# EAGLE design Butterfly_One (EAGLE 5.06)
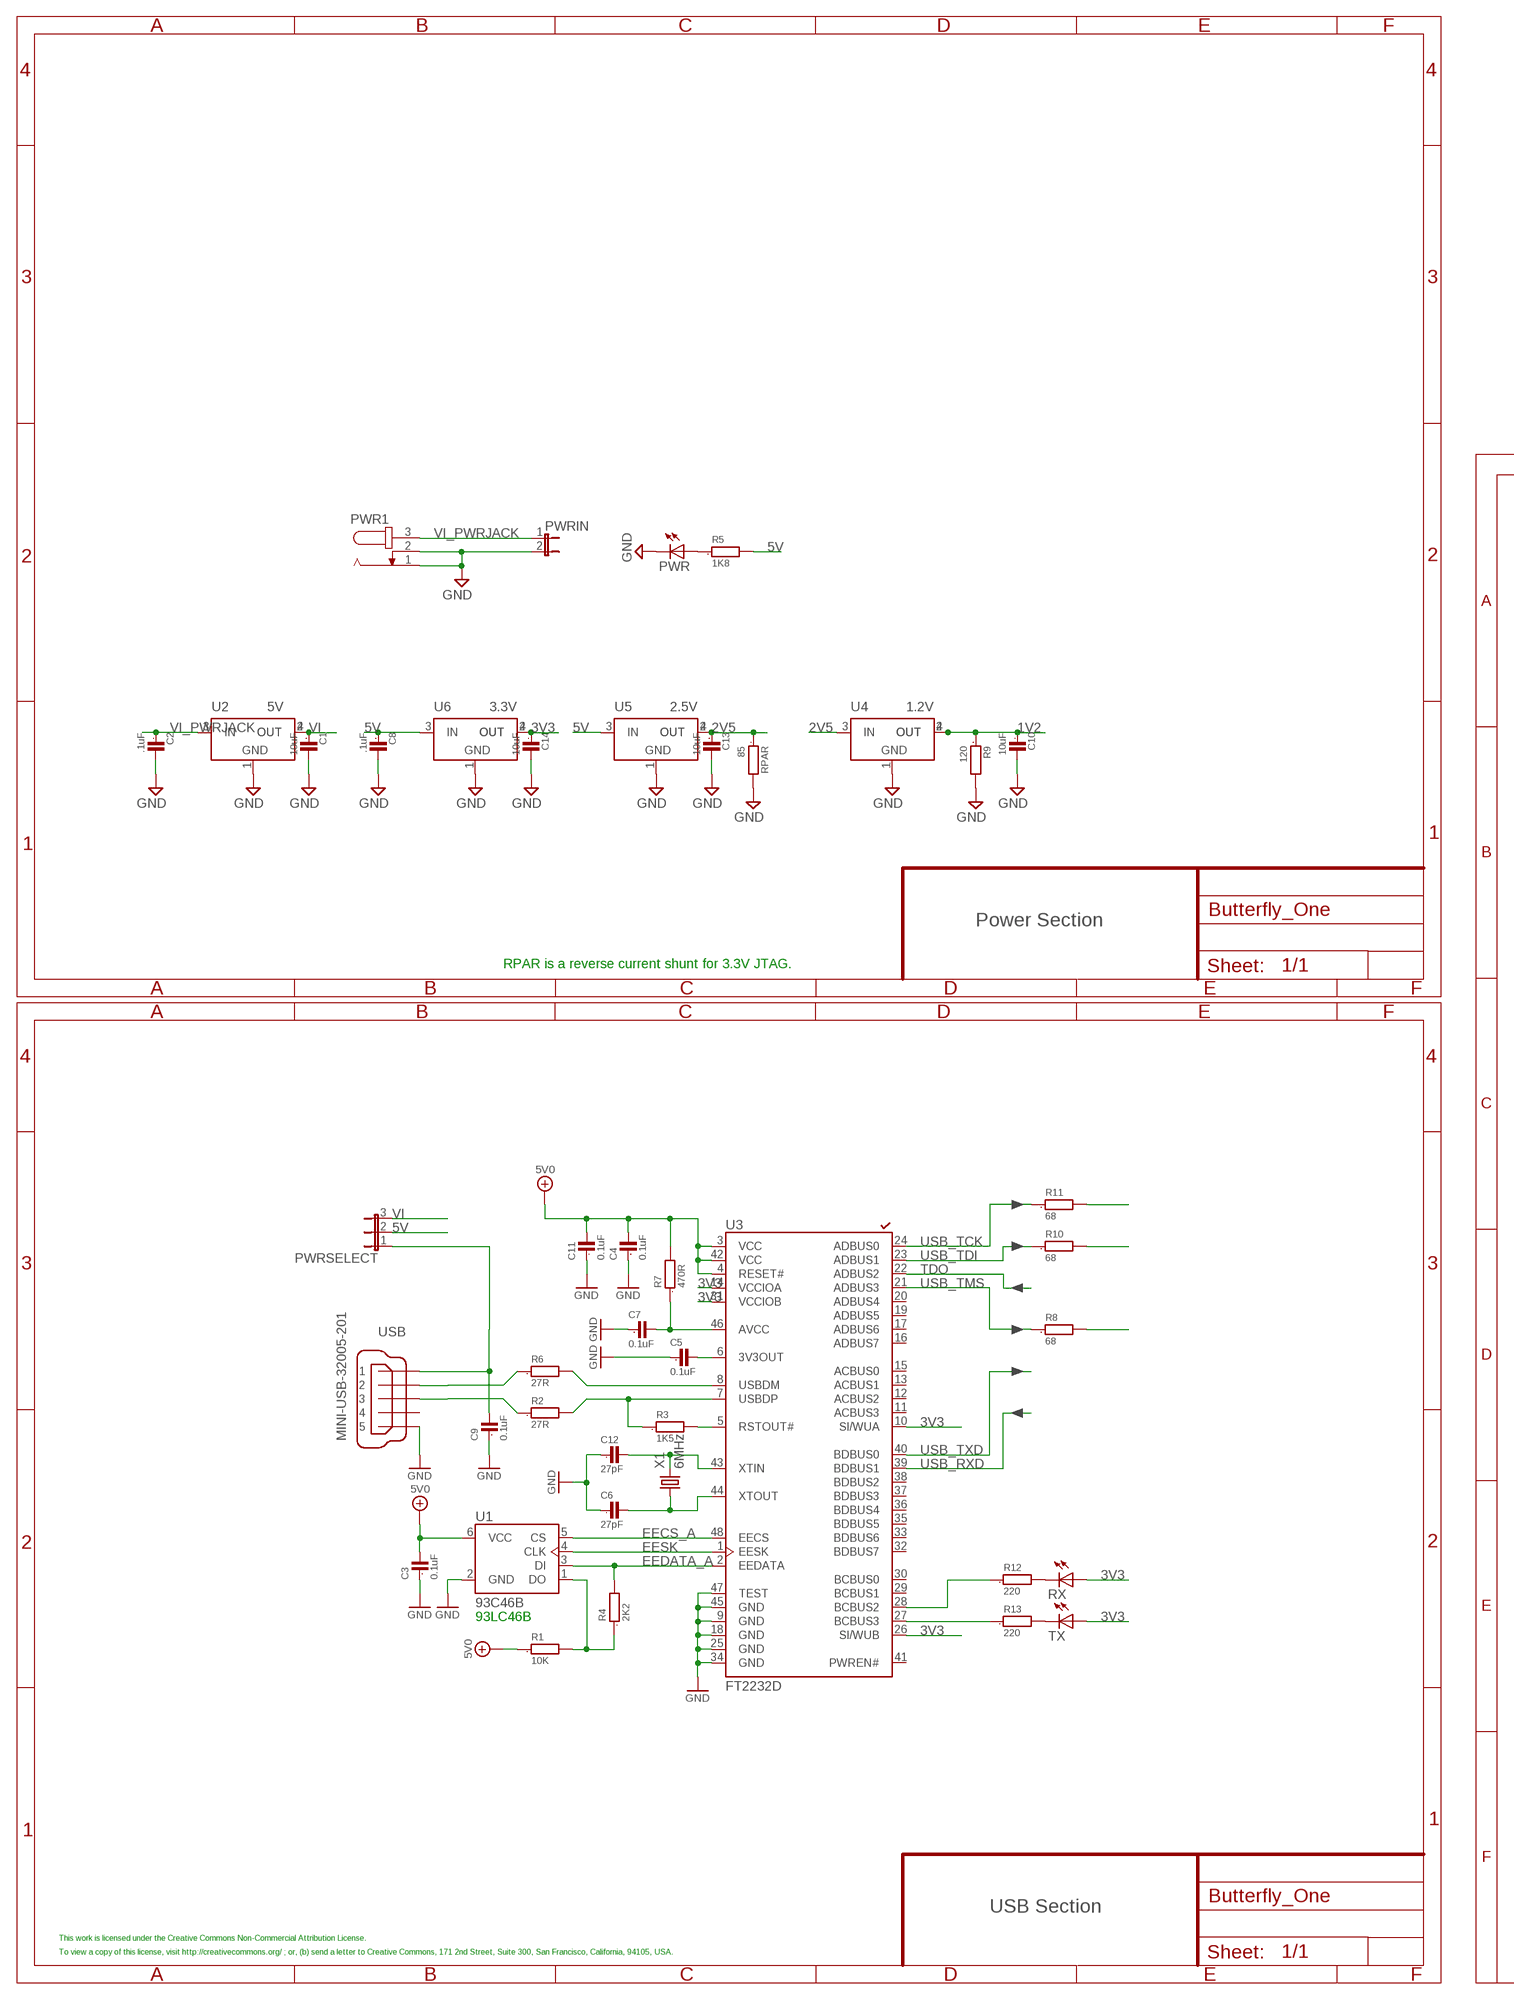
[diagram p0: schematic, sheet 1, part 1 of 2]
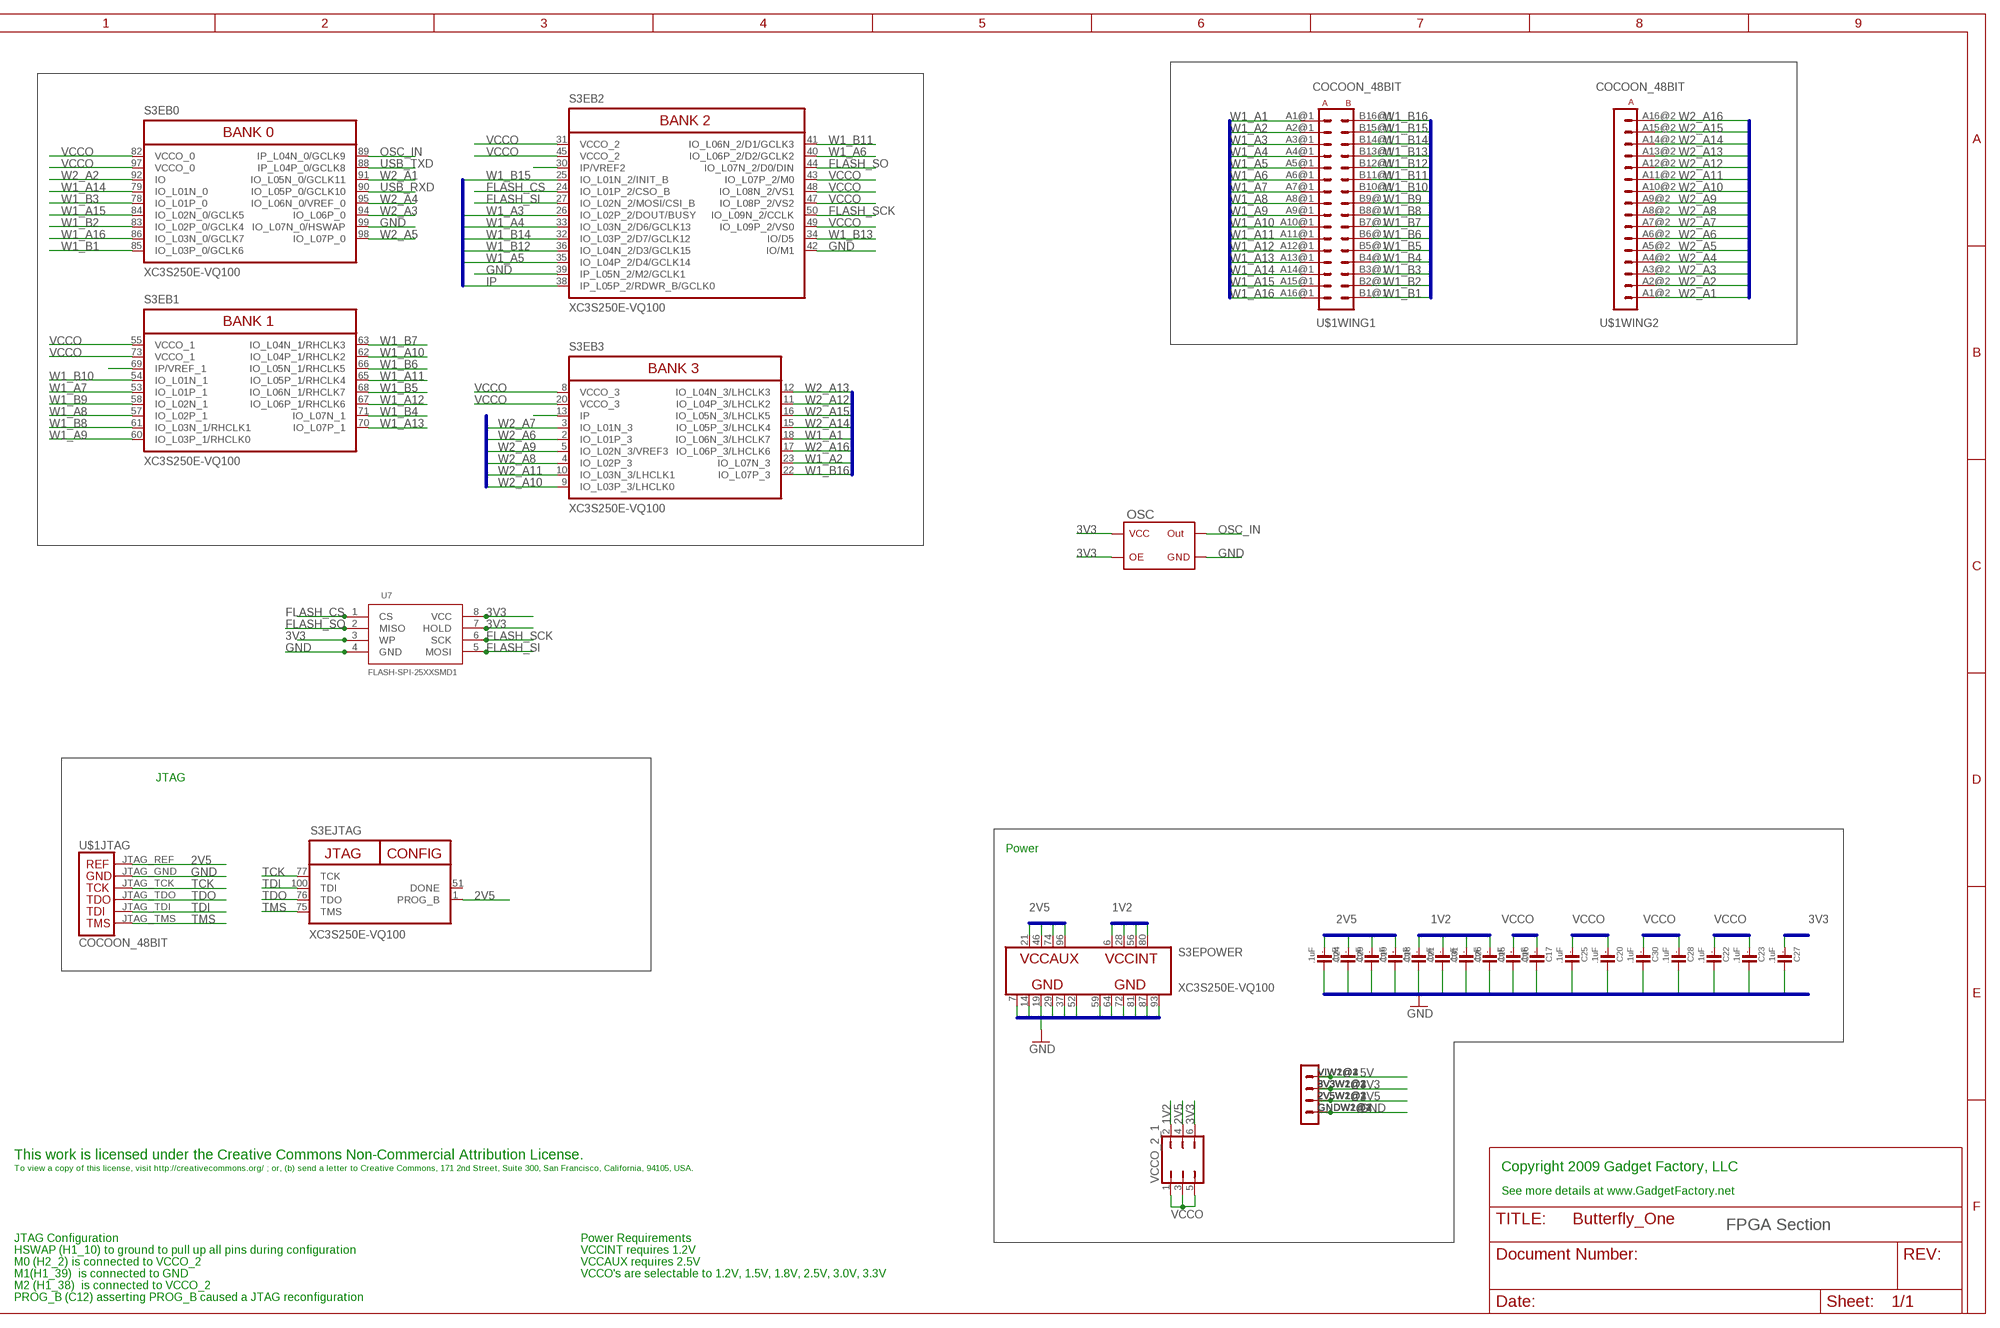
[diagram p1: schematic, sheet 1, part 2 of 2]

## Parts
C1  10uF  C0805  [0805]
C2  .1uF  C0805  [0805]
C3  0.1uF  C0805  [0805]
C4  0.1uF  C0805  [0805]
C5  0.1uF  C0805  [0805]
C6  27pF  C0805  [0805]
C7  0.1uF  C0805  [0805]
C8  .1uF  C0805  [0805]
C9  0.1uF  C0805  [0805]
C10  10uF  C0805  [0805]
C11  0.1uF  C0805  [0805]
C12  27pF  C0805  [0805]
C13  10uF  C0805  [0805]
C14  10uF  C0805  [0805]
C15  .1uF  C0603  [0603]
C16  .1uF  C0603  [0603]
C17  .1uF  C0603  [0603]
C18  .1uF  C0603  [0603]
C19  .1uF  C0603  [0603]
C20  .1uF  C0603  [0603]
C21  .1uF  C0603  [0603]
C22  .1uF  C0603  [0603]
C23  .1uF  C0603  [0603]
C24  .1uF  C0603  [0603]
C25  .1uF  C0603  [0603]
C26  .1uF  C0603  [0603]
C27  .1uF  C0603  [0603]
C28  .1uF  C0603  [0603]
C29  .1uF  C0603  [0603]
C30  .1uF  C0603  [0603]
C31  .1uF  C0603  [0603]
OSC  OSC1  [OSC1]
PWR  LEDCHIP-LED0805  [CHIP-LED0805]
PWR1  JACK-PLUG  [SPC4078-NOSLOT]
PWRIN  JP1E  [JP1]
PWRSELECT  JP2E  [JP2]
R1  10K  R0805  [0805@1]
R2  27R  R0805  [0805@1]
R3  1K5  R0805  [0805@1]
R4  2K2  R0805  [0805@1]
R5  1K8  R0805  [0805]
R6  27R  R0805  [0805@1]
R7  470R  R0805  [0805@1]
R8  68  R0805  [0805]
R9  120  R0805  [0805@1]
R10  68  R0805  [0805]
R11  68  R0805  [0805]
R12  220  R0805  [0805]
R13  220  R0805  [0805]
RPAR  85  R0805  [0805@1]
RX  LEDCHIP-LED0805  [CHIP-LED0805]
S3E  XC3S250E-VQ100  [VQ100]
TX  LEDCHIP-LED0805  [CHIP-LED0805]
U1  93C46B  DIGITAL-EEPROM-MICROWIRE-6P_SOT23  [SOT23-6]
U2  5V  LD1117  [SOT223]
U3  FT2232D  [LQFP48]
U4  1.2V  LD1117  [SOT223]
U5  2.5V  LD1117  [SOT223]
U6  3.3V  LD1117  [SOT223]
U7  FLASH-SPI-25XXSMD1  [SO08-EIAJ]
U$1  COCOON_48BIT  [COCOON_48BIT]
USB  MINI-USB-32005-201  [32005-201]
VCCO_2_1  JP3Q  [JP3Q]
X1  6MHz  CRYSTALHC49S  [HC49/S]

## Nets
1V2: C10.1 C15.1 C21.1 C26.1 C31.1 R9.1 S3E.6(POWER:VCCINT) S3E.28(POWER:VCCINT) S3E.56(POWER:VCCINT) S3E.80(POWER:VCCINT) U4.2(OUT) U4.4(OUT) VCCO_2_1.2
2V5: C13.1 C18.1 C19.1 C24.1 C29.1 RPAR.1 S3E.1(JTAG:PROG_B) S3E.21(POWER:VCCAUX) S3E.46(POWER:VCCAUX) S3E.74(POWER:VCCAUX) S3E.96(POWER:VCCAUX) U4.3(IN) U5.2(OUT) U5.4(OUT) U$1.2V5W1@1(2V5) U$1.2V5W1@2(2V5) U$1.2V5W1@3(2V5) U$1.2V5W1@4(2V5) U$1.2V5W2@1(2V5) U$1.2V5W2@2(2V5) U$1.JTAG_REF(JTAG:JTAG_REF) VCCO_2_1.4
3V3: C14.1 C27.1 OSC.1@1(OE) OSC.4@4(VCC) RX.A TX.A U3.10(SI/WUA) U3.14(VCCIOA) U3.26(SI/WUB) U3.31(VCCIOB) U6.2(OUT) U6.4(OUT) U7.3(WP) U7.7(HOLD) U7.8(VCC) U$1.3V3W1@1(3V3) U$1.3V3W1@2(3V3) U$1.3V3W1@3(3V3) U$1.3V3W1@4(3V3) U$1.3V3W2@1(3V3) U$1.3V3W2@2(3V3) VCCO_2_1.6
3V3OUT_A: C5.2 U3.6(3V3OUT)
5V: C3.2 C4.2 C8.1 C11.2 PWRSELECT.2 R1.1 R5.2 R7.2 U1.6(VCC) U3.3(VCC) U3.4(RESET#) U3.42(VCC) U5.3(IN) U6.3(IN) U$1.VIW1@1(5V) U$1.VIW1@2(5V) U$1.VIW1@3(5V) U$1.VIW1@4(5V) U$1.VIW2@1(5V) U$1.VIW2@2(5V) ; supply symbol labelled 5V0
D+: R2.1 USB.3
D-: R6.1 USB.2
DO_A: R1.2 R4.1 U1.1(DO)
EECS_A: U1.5(CS) U3.48(EECS)
EEDATA_A: R4.2 U1.3(DI) U3.2(EEDATA)
EESK: U1.4(CLK) U3.1(EESK)
FILTERED_VCC_A: C7.2 R7.1 U3.46(AVCC)
FLASH_CS: S3E.24(B2:IO_L01P_2/CSO_B) U7.1(CS)
FLASH_SCK: S3E.50(B2:IO_L09N_2/CCLK) U7.6(SCK)
FLASH_SI: S3E.27(B2:IO_L02N_2/MOSI/CSI_B) U7.5(MOSI)
FLASH_SO: S3E.44(B2:IO_L07N_2/D0/DIN) U7.2(MISO)
GND: C1.2 C2.2 C3.1 C4.1 C5.1 C6.1 C7.1 C8.2 C9.1 C10.2 C11.1 C12.1 C13.2 C14.2 C15.2 C16.2 C17.2 C18.2 C19.2 C20.2 C21.2 C22.2 C23.2 C24.2 C25.2 C26.2 C27.2 C28.2 C29.2 C30.2 C31.2 OSC.2@2(GND) PWR1.1 PWR1.2 PWR.C PWRIN.2 R9.2 RPAR.2 S3E.7(POWER:GND) S3E.14(POWER:GND) S3E.19(POWER:GND) S3E.29(POWER:GND) S3E.37(POWER:GND) S3E.39(B2:IP_L05N_2/M2/GCLK1) S3E.42(B2:IO/M1) S3E.52(POWER:GND) S3E.59(POWER:GND) S3E.64(POWER:GND) S3E.72(POWER:GND) S3E.81(POWER:GND) S3E.87(POWER:GND) S3E.93(POWER:GND) S3E.99(B0:IO_L07N_0/HSWAP) U1.2(GND) U2.1(GND) U3.9(GND) U3.18(GND) U3.25(GND) U3.34(GND) U3.45(GND) U3.47(TEST) U4.1(GND) U5.1(GND) U6.1(GND) U7.4(GND) U$1.GNDW1@1(GND) U$1.GNDW1@2(GND) U$1.GNDW1@3(GND) U$1.GNDW1@4(GND) U$1.GNDW2@1(GND) U$1.GNDW2@2(GND) U$1.JTAG_GND(JTAG:JTAG_GND) USB.5
H1_20: S3E.13(B3:IP)
H1_29: S3E.30(B2:IP/VREF2)
H2_20: S3E.69(B1:IP/VREF_1)
IP: S3E.38(B2:IP_L05P_2/RDWR_B/GCLK0)
N$1: PWR.A R5.1
N$2: R12.2 RX.C
N$3: R13.2 TX.C
N$4: R13.1 U3.27(BCBUS3)
N$5: R12.1 U3.28(BCBUS2)
N$15_A: R3.2 U3.5(RSTOUT#)
OSC_IN: OSC.3@3(OUT) S3E.89(B0:IP_L04N_0/GCLK9)
TCK: R11.2 S3E.77(JTAG:TCK) U$1.JTAG_TCK(JTAG:JTAG_TCK)
TDI: R10.2 S3E.100(JTAG:TDI) U$1.JTAG_TDI(JTAG:JTAG_TDI)
TDO: S3E.76(JTAG:TDO) U3.22(ADBUS2) U$1.JTAG_TDO(JTAG:JTAG_TDO)
TMS: R8.2 S3E.75(JTAG:TMS) U$1.JTAG_TMS(JTAG:JTAG_TMS)
USB_RXD: S3E.90(B0:IO_L05P_0/GCLK10) U3.39(BDBUS1)
USB_TCK: R11.1 U3.24(ADBUS0)
USB_TDI: R10.1 U3.23(ADBUS1)
USB_TMS: R8.1 U3.21(ADBUS3)
USB_TXD: S3E.88(B0:IP_L04P_0/GCLK8) U3.40(BDBUS0)
USBDM_A: R6.2 U3.8(USBDM)
USBDP_A: R2.2 R3.1 U3.7(USBDP)
VBUS_A: C9.2 PWRSELECT.1 USB.1
VCCO: C16.1 C17.1 C20.1 C22.1 C23.1 C25.1 C28.1 C30.1 S3E.8(B3:VCCO_3) S3E.20(B3:VCCO_3) S3E.31(B2:VCCO_2) S3E.43(B2:IO_L07P_2/M0) S3E.45(B2:VCCO_2) S3E.47(B2:IO_L08P_2/VS2) S3E.48(B2:IO_L08N_2/VS1) S3E.49(B2:IO_L09P_2/VS0) S3E.55(B1:VCCO_1) S3E.73(B1:VCCO_1) S3E.82(B0:VCCO_0) S3E.97(B0:VCCO_0) VCCO_2_1.1 VCCO_2_1.3 VCCO_2_1.5
VI: C1.1 PWRSELECT.3 U2.2(OUT) U2.4(OUT)
VI_PWRJACK: C2.1 PWR1.3 PWRIN.1 U2.3(IN)
W1_A1: S3E.18(B3:IO_L06N_3/LHCLK7) U$1.A1@1(WING1:A1)
W1_A2: S3E.23(B3:IO_L07N_3) U$1.A2@1(WING1:A2)
W1_A3: S3E.26(B2:IO_L02P_2/DOUT/BUSY) U$1.A3@1(WING1:A3)
W1_A4: S3E.33(B2:IO_L03N_2/D6/GCLK13) U$1.A4@1(WING1:A4)
W1_A5: S3E.35(B2:IO_L04P_2/D4/GCLK14) U$1.A5@1(WING1:A5)
W1_A6: S3E.40(B2:IO_L06P_2/D2/GCLK2) U$1.A6@1(WING1:A6)
W1_A7: S3E.53(B1:IO_L01P_1) U$1.A7@1(WING1:A7)
W1_A8: S3E.57(B1:IO_L02P_1) U$1.A8@1(WING1:A8)
W1_A9: S3E.60(B1:IO_L03P_1/RHCLK0) U$1.A9@1(WING1:A9)
W1_A10: S3E.62(B1:IO_L04P_1/RHCLK2) U$1.A10@1(WING1:A10)
W1_A11: S3E.65(B1:IO_L05P_1/RHCLK4) U$1.A11@1(WING1:A11)
W1_A12: S3E.67(B1:IO_L06P_1/RHCLK6) U$1.A12@1(WING1:A12)
W1_A13: S3E.70(B1:IO_L07P_1) U$1.A13@1(WING1:A13)
W1_A14: S3E.79(B0:IO_L01N_0) U$1.A14@1(WING1:A14)
W1_A15: S3E.84(B0:IO_L02N_0/GCLK5) U$1.A15@1(WING1:A15)
W1_A16: S3E.86(B0:IO_L03N_0/GCLK7) U$1.A16@1(WING1:A16)
W1_B1: S3E.85(B0:IO_L03P_0/GCLK6) U$1.B1@1(WING1:B1)
W1_B2: S3E.83(B0:IO_L02P_0/GCLK4) U$1.B2@1(WING1:B2)
W1_B3: S3E.78(B0:IO_L01P_0) U$1.B3@1(WING1:B3)
W1_B4: S3E.71(B1:IO_L07N_1) U$1.B4@1(WING1:B4)
W1_B5: S3E.68(B1:IO_L06N_1/RHCLK7) U$1.B5@1(WING1:B5)
W1_B6: S3E.66(B1:IO_L05N_1/RHCLK5) U$1.B6@1(WING1:B6)
W1_B7: S3E.63(B1:IO_L04N_1/RHCLK3) U$1.B7@1(WING1:B7)
W1_B8: S3E.61(B1:IO_L03N_1/RHCLK1) U$1.B8@1(WING1:B8)
W1_B9: S3E.58(B1:IO_L02N_1) U$1.B9@1(WING1:B9)
W1_B10: S3E.54(B1:IO_L01N_1) U$1.B10@1(WING1:B10)
W1_B11: S3E.41(B2:IO_L06N_2/D1/GCLK3) U$1.B11@1(WING1:B11)
W1_B12: S3E.36(B2:IO_L04N_2/D3/GCLK15) U$1.B12@1(WING1:B12)
W1_B13: S3E.34(B2:IO/D5) U$1.B13@1(WING1:B13)
W1_B14: S3E.32(B2:IO_L03P_2/D7/GCLK12) U$1.B14@1(WING1:B14)
W1_B15: S3E.25(B2:IO_L01N_2/INIT_B) U$1.B15@1(WING1:B15)
W1_B16: S3E.22(B3:IO_L07P_3) U$1.B16@1(WING1:B16)
W2_A1: S3E.91(B0:IO_L05N_0/GCLK11) U$1.A1@2(WING2:A1)
W2_A2: S3E.92(B0:IO) U$1.A2@2(WING2:A2)
W2_A3: S3E.94(B0:IO_L06P_0) U$1.A3@2(WING2:A3)
W2_A4: S3E.95(B0:IO_L06N_0/VREF_0) U$1.A4@2(WING2:A4)
W2_A5: S3E.98(B0:IO_L07P_0) U$1.A5@2(WING2:A5)
W2_A6: S3E.2(B3:IO_L01P_3) U$1.A6@2(WING2:A6)
W2_A7: S3E.3(B3:IO_L01N_3) U$1.A7@2(WING2:A7)
W2_A8: S3E.4(B3:IO_L02P_3) U$1.A8@2(WING2:A8)
W2_A9: S3E.5(B3:IO_L02N_3/VREF3) U$1.A9@2(WING2:A9)
W2_A10: S3E.9(B3:IO_L03P_3/LHCLK0) U$1.A10@2(WING2:A10)
W2_A11: S3E.10(B3:IO_L03N_3/LHCLK1) U$1.A11@2(WING2:A11)
W2_A12: S3E.11(B3:IO_L04P_3/LHCLK2) U$1.A12@2(WING2:A12)
W2_A13: S3E.12(B3:IO_L04N_3/LHCLK3) U$1.A13@2(WING2:A13)
W2_A14: S3E.15(B3:IO_L05P_3/LHCLK4) U$1.A14@2(WING2:A14)
W2_A15: S3E.16(B3:IO_L05N_3/LHCLK5) U$1.A15@2(WING2:A15)
W2_A16: S3E.17(B3:IO_L06P_3/LHCLK6) U$1.A16@2(WING2:A16)
XTIN_A: C12.2 U3.43(XTIN) X1.2
XTOUT_A: C6.2 U3.44(XTOUT) X1.1
Unconnected: S3E.51(JTAG:DONE) U3.11(ACBUS3) U3.12(ACBUS2) U3.13(ACBUS1) U3.15(ACBUS0) U3.16(ADBUS7) U3.17(ADBUS6) U3.19(ADBUS5) U3.20(ADBUS4) U3.29(BCBUS1) U3.30(BCBUS0) U3.32(BDBUS7) U3.33(BDBUS6) U3.35(BDBUS5) U3.36(BDBUS4) U3.37(BDBUS3) U3.38(BDBUS2) U3.41(PWREN#) USB.4

## Buses
H1_[1..40]
GND
2V5
1V2
H2_[1..40]
VCCO
3V3
W1_A[1..16],W1_B[1..16]

## Notes on the sheet
- Power Section
- RPAR is a reverse current shunt for 3.3V JTAG.
- JTAG
- Power
- 93LC46B
- This work is licensed under the Creative Commons Non-Commercial Attribution License.
- To view a copy of this license, visit http://creativecommons.org/ ; or, (b) send a letter to Creative Commons, 171 2nd Street, Suite 300, San Francisco, California, 94105, USA. | Copyright 2009 Gadget Factory, LLC
- See more details at www.GadgetFactory.net
- FPGA Section
- JTAG Configuration | Power Requirements
- USB Section | HSWAP (H1_10) to ground to pull up all pins during configuration | VCCINT requires 1.2V
- M0 (H2_2) is connected to VCCO_2 | VCCAUX requires 2.5V
- This work is licensed under the Creative Commons Non-Commercial Attribution License. | M1(H1_39)  is connected to GND | VCCO's are selectable to 1.2V, 1.5V, 1.8V, 2.5V, 3.0V, 3.3V
- To view a copy of this license, visit http://creativecommons.org/ ; or, (b) send a letter to Creative Commons, 171 2nd Street, Suite 300, San Francisco, California, 94105, USA. | M2 (H1_38)  is connected to VCCO_2
- PROG_B (C12) asserting PROG_B caused a JTAG reconfiguration

## Library data of the parts
C1 C2 C8 C10 C13-C31 = GadgetFactory:C: CAPACITOR, European symbol
C3-C7 C9 C11 C12 = Bogdan_Commons:C: CAPACITOR, European symbol
OSC = MondoCPLDCore-XC95_Rev1.5:OSC1
PWR RX TX = led:LED: LED OSRAM: - CHIPLED LG R971, LG N971, LY N971, LG Q971, LY Q971, LO R971, LY R971 LH N974, LH R974 LS Q976, LO Q976, LY Q976 LO Q996 - Hyper CHIPLED LW Q18S LB Q993, LB Q99A, LB R99A - SideLED LS A670, LO A670, LY A670, LG A670, LP A670 LB A673, LV A673, LT A673, LW A673 LH A674 LY A675 LS A676, LA A676, LO A676, LY A676, LW A676 LS A679, LY A679, LG A679 - Hyper Micro SIDELED® LS Y876, LA Y876, LO Y876, LY Y876 LT Y87S - SmartLED LW L88C, LW L88S LB L89C, LB L89S, LG L890 LS L89K, LO L89K, LY L89K LS L896, LA L896, LO L896, LY L896 - TOPLED LS T670, LO T670, LY T670, LG T670, LP T670 LSG T670, LSP T670, LSY T670, LOP T670, LYG T670 LG T671, LOG T671, LSG T671 LB T673, LV T673, LT T673, LW T673 LH T674 LS T676, LA T676, LO T676, LY T676, LB T676, LH T676, LSB T676, LW T676 LB T67C, LV T67C, LT T67C, LS T67K, LO T67K, LY T67K, LW E67C LS E67B, LA E67B, LO E67B, LY E67B, LB E67C, LV E67C, LT E67C LW T67C LS T679, LY T679, LG T679 LS T770, LO T770, LY T770, LG T770, LP T770 LB T773, LV T773, LT T773, LW T773 LH T774 LS E675, LA E675, LY E675, LS T675 LS T776, LA T776, LO T776, LY T776, LB T776 LHGB T686 LT T68C, LB T68C - Hyper Mini TOPLED® LB M676 - Mini TOPLED Santana® LG M470 LS M47K, LO M47K, LY M47K Source: http://www.osram.convergy.de LUXEON: - LUMILED® LXK2-PW12-R00, LXK2-PW12-S00, LXK2-PW14-U00, LXK2-PW14-V00 LXK2-PM12-R00, LXK2-PM12-S00, LXK2-PM14-U00 LXK2-PE12-Q00, LXK2-PE12-R00, LXK2-PE12-S00, LXK2-PE14-T00, LXK2-PE14-U00 LXK2-PB12-K00, LXK2-PB12-L00, LXK2-PB12-M00, LXK2-PB14-N00, LXK2-PB14-P00, LXK2-PB14-Q00 LXK2-PR12-L00, LXK2-PR12-M00, LXK2-PR14-Q00, LXK2-PR14-R00 LXK2-PD12-Q00, LXK2-PD12-R00, LXK2-PD12-S00 LXK2-PH12-R00, LXK2-PH12-S00 LXK2-PL12-P00, LXK2-PL12-Q00, LXK2-PL12-R00 Source: www.luxeon.com KINGBRIGHT: KA-3528ASYC Source: www.kingbright.com
PWR1 = GadgetFactory:JACK-PLUG: DC POWER JACK Power Jack, DC, Right Angle, Through Hole, Rated 5A at 16VDC, PC Terminals Distributor: Farnell (www.Farnell.de) Drawing: 84N1161.pdf / 84N1162.pdf Manufacturer: SPC Technology (www.spctechnology.com) Type: SPC4077 / SPC 4078
PWRIN = jumper:JP1E: JUMPER
PWRSELECT = jumper:JP2E: JUMPER
R1-R4 R6 R7 R9 RPAR = Bogdan_Commons:R: RESISTOR, European symbol
R5 R8 R10-R13 = GadgetFactory:R: RESISTOR, European symbol
S3E = xilinx-xc3sxxxe_vq100:XC3S250E: Xilinx Spartan 3E FPGA
U1 = Bogdan_Commons:DIGITAL-EEPROM-MICROWIRE-6P
U2 U4-U6 = GadgetFactory:LD1117
U3 = Bogdan_Commons:FT2232D
U7 = GadgetFactory:FLASH-SPI-25XX: SPI Flash
U$1 = GadgetFactory_Pub:COCOON_48BIT
USB = con-cypressindustries:MINI-USB-: MINI USB-B Conector Source: www.cypressindustries.com
VCCO_2_1 = GadgetFactory:JP3Q: JUMPER
X1 = crystal:CRYSTAL: CRYSTAL

## Net classes
0 default: width 0.178 mm, drill 0.381 mm, clearance 0.178 mm
1 Power: width 0.813 mm, drill 0.381 mm, clearance 0.178 mm

## Board
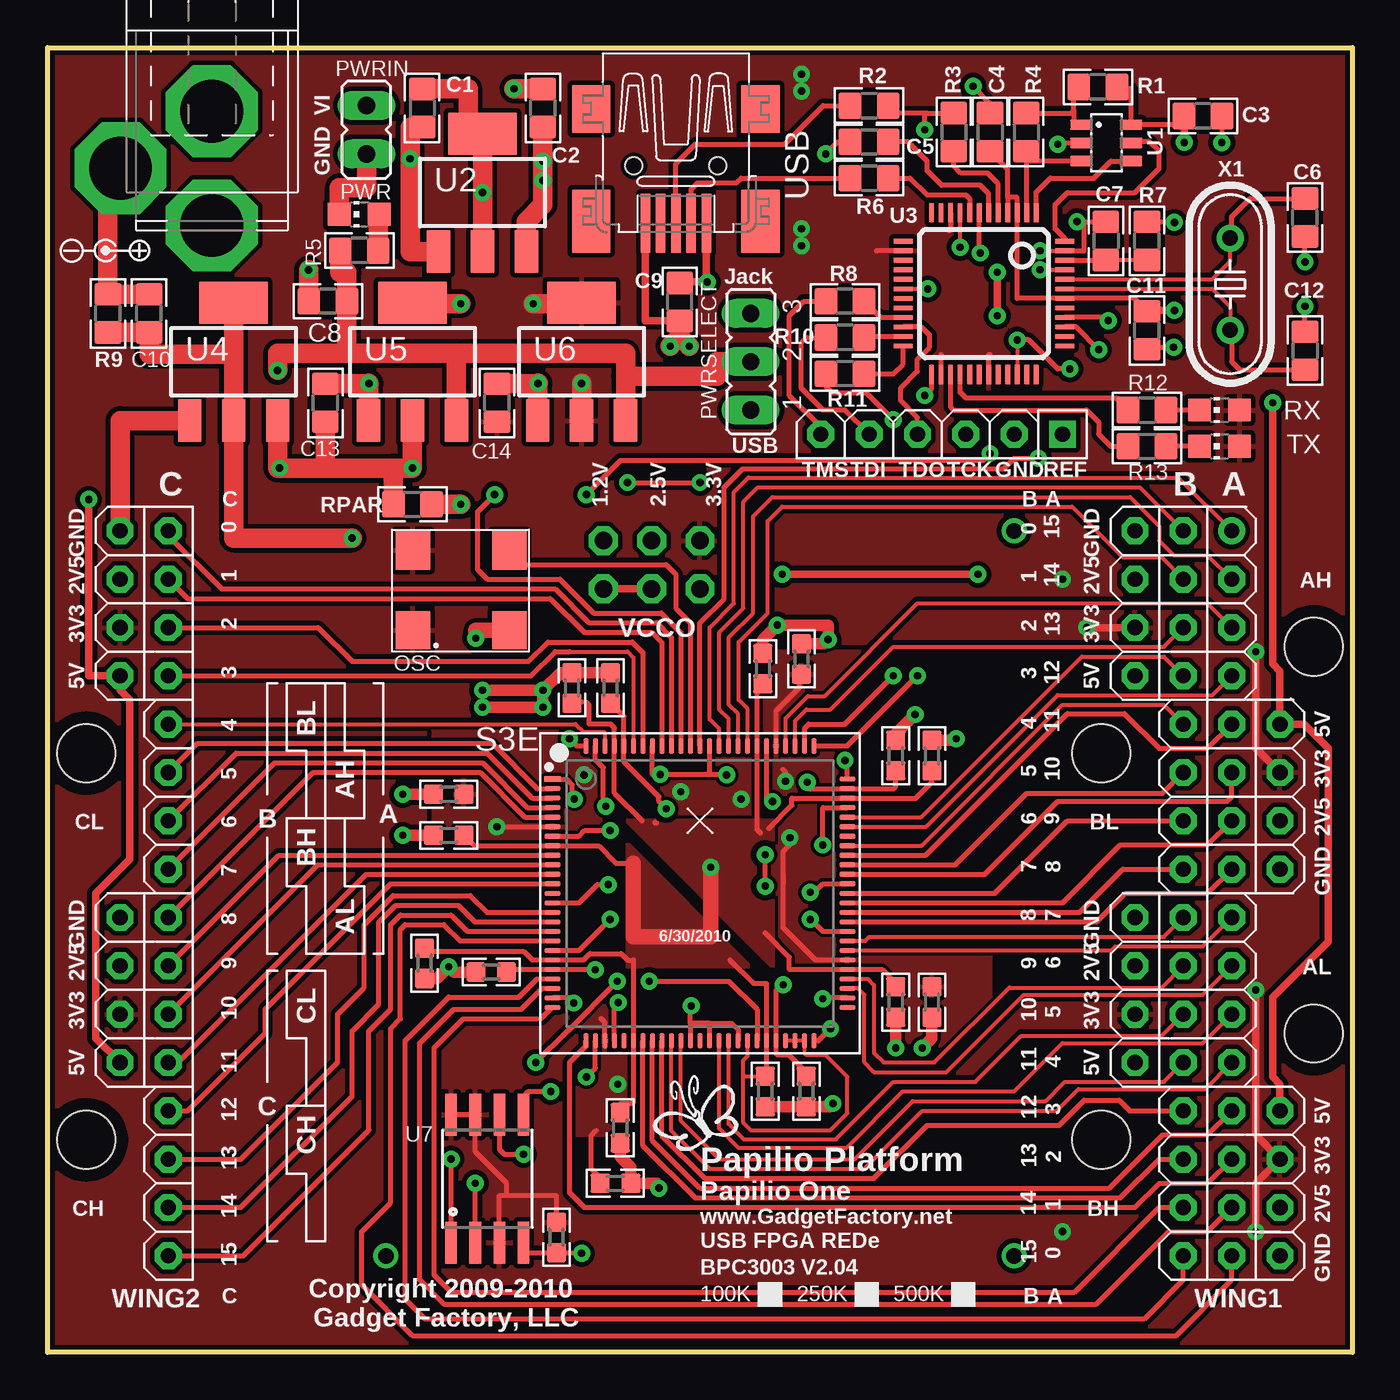
[diagram p2: board, top side]
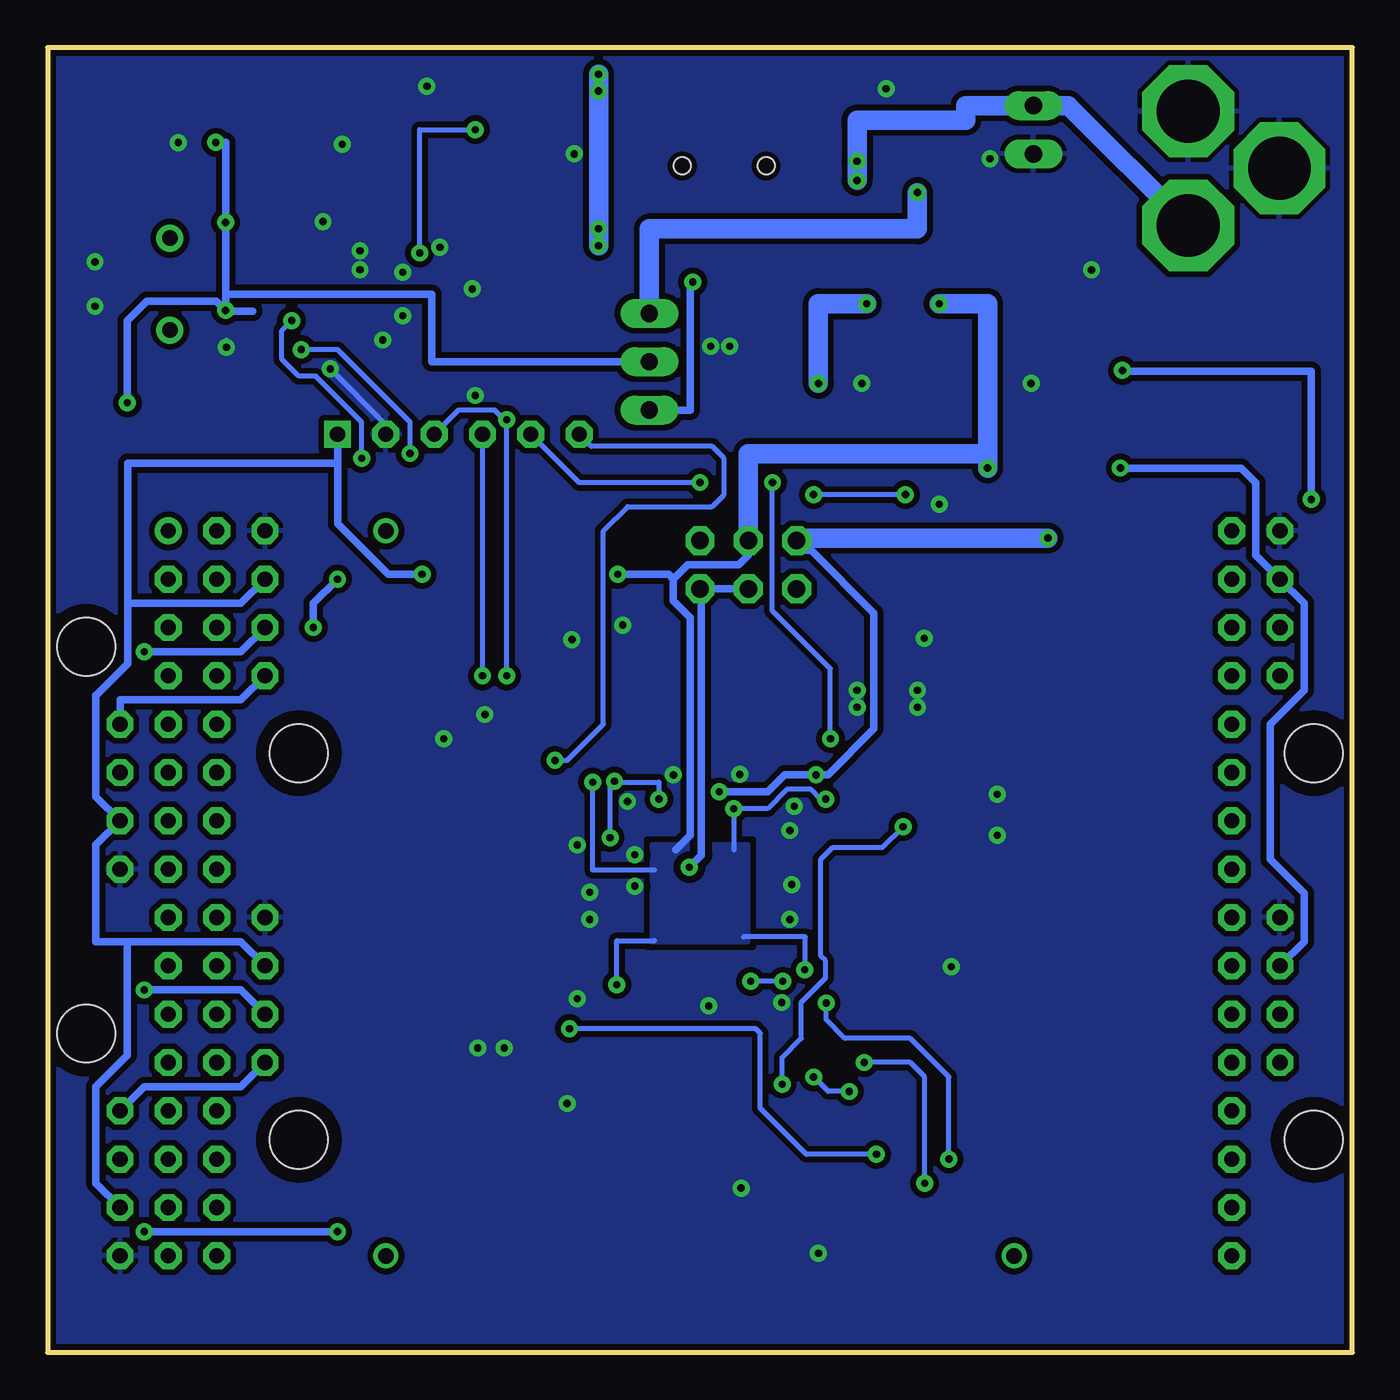
[diagram p3: board, bottom side, seen from below]

Size 68.58 x 68.58 mm. Coordinates in mm from the lower left corner, seen from the top.
Outline: 0,68.58 68.58,68.58 68.58,0 0,0 0,68.58
Copper layers (1*16): Top 0.035mm / dielectric 1.5mm / Bottom 0.035mm
Design rules "SparkFun_Derived_GoldePheonix_10mil *": minimum track width 7mil, minimum drill 15mil, track to track 7mil, track to pad 7mil, pad to pad 7mil, via to via 7mil, smd to smd 7mil, copper to edge 10mil, drill to drill 8mil, minimum pad ring 12mil, minimum via ring 10mil, stop-mask expansion 4mil, vias tented up to drill 33mil, thermal gap 10mil

### Footprints (pad centres in the part's own frame; a part is rotated, then mirrored left to right if it is on the bottom)
0805 = smd 1.2 x 1.4: 1 -1,0; 2 1,0
0603 = smd 1 x 1: 1 -0.8,0; 2 0.8,0
OSC1 = smd 1.8 x 2: 1@1 0,0; 2@2 5.08,0; 3@3 5.08,4.2; 4@4 0,4.2
CHIP-LED0805 = smd 1.2 x 1.2: A 0,-1.05; C 0,1.05
SPC4078-NOSLOT = drill 3.302 pad 4.826 octagon: 1 -3,0; 2 0,-4.8; 3 3,0
JP1 = drill 0.914 long: 1 0,-1.27; 2 0,1.27
JP2 = drill 0.914 long: 1 -2.54,0; 2 0,0; 3 2.54,0
0805@1 = smd 1.2 x 1.4: 1 -1,0; 2 1,0
VQ100 = smd 0.85 x 0.28: 1 -7.75,6; 2 -7.75,5.5; 3 -7.75,5; 4 -7.75,4.5; 5 -7.75,4; 6 -7.75,3.5; 7 -7.75,3; 8 -7.75,2.5; 9 -7.75,2; 10 -7.75,1.5; 11 -7.75,1; 12 -7.75,0.5; 13 -7.75,0; 14 -7.75,-0.5; 15 -7.75,-1; 16 -7.75,-1.5; 17 -7.75,-2; 18 -7.75,-2.5; 19 -7.75,-3; 20 -7.75,-3.5; 21 -7.75,-4; 22 -7.75,-4.5; 23 -7.75,-5; 24 -7.75,-5.5; 25 -7.75,-6; 51 7.75,-6; 52 7.75,-5.5; 53 7.75,-5; 54 7.75,-4.5; 55 7.75,-4; 56 7.75,-3.5; 57 7.75,-3; 58 7.75,-2.5; 59 7.75,-2; 60 7.75,-1.5; 61 7.75,-1; 62 7.75,-0.5; 63 7.75,0; 64 7.75,0.5; 65 7.75,1; 66 7.75,1.5; 67 7.75,2; 68 7.75,2.5; 69 7.75,3; 70 7.75,3.5; 71 7.75,4; 72 7.75,4.5; 73 7.75,5; 74 7.75,5.5; 75 7.75,6 | smd 0.28 x 0.85: 26 -6,-7.75; 27 -5.5,-7.75; 28 -5,-7.75; 29 -4.5,-7.75; 30 -4,-7.75; 31 -3.5,-7.75; 32 -3,-7.75; 33 -2.5,-7.75; 34 -2,-7.75; 35 -1.5,-7.75; 36 -1,-7.75; 37 -0.5,-7.75; 38 0,-7.75; 39 0.5,-7.75; 40 1,-7.75; 41 1.5,-7.75; 42 2,-7.75; 43 2.5,-7.75; 44 3,-7.75; 45 3.5,-7.75; 46 4,-7.75; 47 4.5,-7.75; 48 5,-7.75; 49 5.5,-7.75; 50 6,-7.75; 76 6,7.75; 77 5.5,7.75; 78 5,7.75; 79 4.5,7.75; 80 4,7.75; 81 3.5,7.75; 82 3,7.75; 83 2.5,7.75; 84 2,7.75; 85 1.5,7.75; 86 1,7.75; 87 0.5,7.75; 88 0,7.75; 89 -0.5,7.75; 90 -1,7.75; 91 -1.5,7.75; 92 -2,7.75; 93 -2.5,7.75; 94 -3,7.75; 95 -3.5,7.75; 96 -4,7.75; 97 -4.5,7.75; 98 -5,7.75; 99 -5.5,7.75; 100 -6,7.75
SOT23-6 = smd 0.55 x 1.2: 1 -0.95,-1.3; 2 0,-1.3; 3 0.95,-1.3; 4 0.95,1.3; 5 0,1.3; 6 -0.95,1.3
SOT223 = smd 1.219 x 2.235: 1 -2.311,-3.099; 2 0,-3.099; 3 2.311,-3.099 | smd 3.6 x 2.2: 4 0,3.099
LQFP48 = smd 0.25 x 1: 1 -2.75,-4.25; 2 -2.25,-4.25; 3 -1.75,-4.25; 4 -1.25,-4.25; 5 -0.75,-4.25; 6 -0.25,-4.25; 7 0.25,-4.25; 8 0.75,-4.25; 9 1.25,-4.25; 10 1.75,-4.25; 11 2.25,-4.25; 12 2.75,-4.25; 25 2.75,4.25; 26 2.25,4.25; 27 1.75,4.25; 28 1.25,4.25; 29 0.75,4.25; 30 0.25,4.25; 31 -0.25,4.25; 32 -0.75,4.25; 33 -1.25,4.25; 34 -1.75,4.25; 35 -2.25,4.25; 36 -2.75,4.25 | smd 1 x 0.25: 13 4.25,-2.75; 14 4.25,-2.25; 15 4.25,-1.75; 16 4.25,-1.25; 17 4.25,-0.75; 18 4.25,-0.25; 19 4.25,0.25; 20 4.25,0.75; 21 4.25,1.25; 22 4.25,1.75; 23 4.25,2.25; 24 4.25,2.75; 37 -4.25,2.75; 38 -4.25,2.25; 39 -4.25,1.75; 40 -4.25,1.25; 41 -4.25,0.75; 42 -4.25,0.25; 43 -4.25,-0.25; 44 -4.25,-0.75; 45 -4.25,-1.25; 46 -4.25,-1.75; 47 -4.25,-2.25; 48 -4.25,-2.75
SO08-EIAJ = smd 0.61 x 2.21: 1 -1.905,-3.378; 2 -0.635,-3.378; 3 0.635,-3.378; 4 1.905,-3.378; 5 1.905,3.353; 6 0.635,3.353; 7 -0.635,3.353; 8 -1.905,3.353
COCOON_48BIT = drill 0.8 octagon: 2V5W1@1 57.15,40.64; 2V5W1@2 64.77,27.94; 2V5W1@3 57.15,20.32; 2V5W1@4 64.77,7.62; 2V5W2@1 3.81,40.64; 2V5W2@2 3.81,20.32; 3V3W1@1 57.15,38.1; 3V3W1@2 64.77,30.48; 3V3W1@3 57.15,17.78; 3V3W1@4 64.77,10.16; 3V3W2@1 3.81,38.1; 3V3W2@2 3.81,17.78; A1@1 62.23,5.08; A1@2 6.35,43.18; A2@1 62.23,7.62; A2@2 6.35,40.64; A3@1 62.23,10.16; A3@2 6.35,38.1; A4@1 62.23,12.7; A4@2 6.35,35.56; A5@1 62.23,15.24; A5@2 6.35,33.02; A6@1 62.23,17.78; A6@2 6.35,30.48; A7@1 62.23,20.32; A7@2 6.35,27.94; A8@1 62.23,22.86; A8@2 6.35,25.4; A9@1 62.23,25.4; A9@2 6.35,22.86; A10@1 62.23,27.94; A10@2 6.35,20.32; A11@1 62.23,30.48; A11@2 6.35,17.78; A12@1 62.23,33.02; A12@2 6.35,15.24; A13@1 62.23,35.56; A13@2 6.35,12.7; A14@1 62.23,38.1; A14@2 6.35,10.16; A15@1 62.23,40.64; A15@2 6.35,7.62; A16@2 6.35,5.08; B1@1 59.69,43.18; B2@1 59.69,40.64; B3@1 59.69,38.1; B4@1 59.69,35.56; B5@1 59.69,33.02; B6@1 59.69,30.48; B7@1 59.69,27.94; B8@1 59.69,25.4; B9@1 59.69,22.86; B10@1 59.69,20.32; B11@1 59.69,17.78; B12@1 59.69,15.24; B13@1 59.69,12.7; B14@1 59.69,10.16; B15@1 59.69,7.62; B16@1 59.69,5.08; GNDW1@1 57.15,43.18; GNDW1@2 64.77,25.4; GNDW1@3 57.15,22.86; GNDW1@4 64.77,5.08; GNDW2@1 3.81,43.18; GNDW2@2 3.81,22.86; JTAG_GND 50.8,48.26; JTAG_TCK 48.26,48.26; JTAG_TDI 43.18,48.26; JTAG_TDO 45.72,48.26; JTAG_TMS 40.64,48.26; VIW1@1 57.15,35.56; VIW1@2 64.77,33.02; VIW1@3 57.15,15.24; VIW1@4 64.77,12.7; VIW2@1 3.81,35.56; VIW2@2 3.81,15.24 | drill 0.8 round: A16@1 62.23,43.18 | drill 0.8 square: JTAG_REF 53.34,48.26 | hole 3.048: 2.032,31.496; 2.032,11.176; 55.372,11.176; 66.548,16.764; 55.372,31.496; 66.548,37.084
32005-201 = smd 3.1 x 0.5: 1 3,1.6; 2 3,0.8; 3 3,0; 4 3,-0.8; 5 3,-1.6 | smd 2.5 x 2: M1 -3,-4.45; M2 -3,4.45 | smd 3.3 x 2: M3 2.9,4.45; M4 2.9,-4.45 | hole 0.9: 0,2.2; 0,-2.2
JP3Q = drill 0.914 octagon: 1 -2.54,-1.27; 2 -2.54,1.27; 3 0,-1.27; 4 0,1.27; 5 2.54,-1.27; 6 2.54,1.27
HC49/S = drill 0.813 round: 1 -2.413,0; 2 2.413,0

### Placement (x,y rotation side)
C1  19.68,65.41 270 top
C2  26.04,65.41 90 top
C3  60.72,64.98 180 top
C4  49.53,64.14 270 top
C5  43.18,63.63 0 top
C6  66.09,59.65 90 top
C7  55.63,58.42 270 top
C8  14.73,55.24 180 top
C9  33.23,55.21 90 top
C10  5.33,54.61 90 top
C11  57.78,53.72 90 top
C12  66.09,52.65 270 top
C13  14.61,49.91 90 top
C14  23.62,49.91 90 top
C15  39.62,36.45 90 top
C16  37.59,35.94 90 top
C17  27.56,34.92 90 top
C18  29.59,34.92 90 top
C19  44.58,31.37 90 top
C20  46.48,31.37 90 top
C21  21.08,29.34 180 top
C22  21.08,27.18 180 top
C23  19.81,20.45 270 top
C24  23.32,19.99 180 top
C25  44.58,18.41 270 top
C26  46.48,18.41 270 top
C27  26.75,6.05 270 top
C28  37.72,13.72 270 top
C29  39.88,13.72 270 top
C30  30.1,11.81 270 top
C31  29.84,8.89 0 top
OSC  19.2,37.95 0 top
PWR  16.38,59.82 90 top
PWR1  8.64,62.23 270 top
PWRIN  16.76,64.26 180 top
PWRSELECT  36.96,52.07 90 top
R1  55.2,66.51 180 top
R2  43.18,65.53 0 top
R3  47.62,64.14 270 top
R4  51.44,64.14 270 top
R5  16.38,57.91 180 top
R6  43.18,61.72 0 top
R7  57.78,58.42 90 top
R8  41.91,55.24 180 top
R9  3.17,54.61 90 top
R10  41.91,53.34 180 top
R11  41.91,51.44 180 top
R12  57.78,49.53 0 top
R13  57.78,47.62 0 top
RPAR  19.18,44.58 0 top
RX  61.59,49.53 90 top
S3E  34.29,24.13 0 top
TX  61.59,47.62 90 top
U1  55.65,63.57 270 top
U2  22.86,60.96 0 top
U3  49.21,55.65 180 top
U4  9.78,52.07 0 top
U5  19.18,52.07 0 top
U6  28.07,52.07 0 top
U7  23.11,9.14 0 top
U$1  0,0 0 top
U$2  [TIP_POS_POLARITY]  3.05,57.91 0 top
U$3  [GADGETFACTORY_LOGO]  31.62,10.03 0 top
U$4  [CHIP_SIZE_MARKUP]  34.29,2.67 0 top
USB  33.02,62.36 270 top
VCCO_2_1  31.75,41.4 0 top
X1  62.15,56.15 270 top

### Tracks (layer width: path | path; a pad name or v marks a point on that pad's centre or on a via)
1V2  (via drill 0.38)
  Top 0.254: 38.66,25.15 38.66,24.61 | 38.66,25.15 38.66,26.31 38.94,26.59 38.94,26.98 v39.01,27.05 | v38.79,30.02 38.79,30.48 38.63,30.63 | S3E.56 40.36,20.63 38.66,22.33 38.66,25.15 | S3E.28 29.29,17.34 29.08,17.55 | v23.62,27.63 S3E.6 | S3E.80 38.29,33.72 39.5,34.92 39.5,35.52 C15.1 | C31.1 29.05,9.18 28.57,9.65 28.57,11.4 28.84,11.67
  Top 1.016: R9.1 C10.1 5.33,52.45 9.78,52.45 | 9.78,52.45 U4.2 9.78,42.8 v16,42.8 | 9.78,52.45 U4.4
  Bottom 0.254: v39.01,27.05 39.01,29.79 v38.79,30.02 | 38.73,29.97 36.45,29.97 v36.45,29.08 | v29.97,14.1 29.97,15.49 28.96,16.51 28.96,18.41 27.69,19.68 27.69,20.57 27.94,20.83 27.94,25.91 27.3,26.54 24.7,26.54 v23.62,27.63
  Bottom 0.406: v38.79,30.02 38.73,29.97 | v33.27,29.46 30.73,29.46 29.84,30.35 v28.19,30.35 27.56,30.35 25.15,32.77 25.15,38.86 28.45,42.16 29.21,42.16 VCCO_2_1.2
  Bottom 1.016: v16,42.8 29.08,42.8 VCCO_2_1.2
  pour Top (rank 2): 20.32,36.83 49.53,36.83 49.53,11.43 20.32,11.43
2V5  (via drill 0.38)
  Top 0.254: v38.66,19.33 38.59,19.33 38.29,19.02 S3E.46 38.29,15.69 38.35,15.62 38.99,15.62 39.12,15.49 39.12,15.48 39.88,14.72 C29.1 | v39.93,29.97 39.93,29.63 S3E.74 44.49,29.63 44.58,29.72 C19.1 | v32.51,28.57 32.13,28.96 32.13,29.21 30.29,31.05 S3E.96 30.29,33.43 C18.1 | v28.78,20.12 28.77,20.13 S3E.21 24.26,20.13 C24.1 | S3E.1 27.27,30.13 27.56,29.84 27.56,29.21 v27.69,29.08
  Top 0.406: v38.61,40.89 v48.9,40.89 | 12.09,46.99 12.19,46.89
  Top 1.016: 14.61,46.48 C13.1 | 14.61,46.48 18.16,46.48 | 18.16,46.48 v19.18,46.48 U5.2 | RPAR.1 18.18,46.47 18.16,46.48 | v21.72,55.12 19.23,55.12 U5.4 | U4.3 12.09,46.99 12.09,46.48 v12.19,46.48 14.61,46.48
  Bottom 0.254: v38.66,19.33 38.66,21.64 36.68,21.64 | v39.93,29.97 39.93,25.35 36.68,25.35 | 32.51,26.42 v32.51,28.57 30.73,28.57 29.72,29.59 28.45,29.59 27.94,29.08 v27.69,29.08 | 32,21.84 28.75,21.84 28.75,20.14 v28.78,20.12
  Bottom 0.406: U$1.2V5W1@3 58.42,21.59 64.26,21.59 | 64.26,21.59 66.04,21.59 66.04,26.67 U$1.2V5W1@2 66.04,29.21 66.04,34.54 66.02,34.54 64.36,36.2 64.36,39.37 | U$1.2V5W1@1 58.42,39.37 64.36,39.37 | U$1.2V5W2@2 2.54,21.59 2.54,24.13 4.32,25.91 4.32,33.02 2.54,34.8 2.54,39.37 U$1.2V5W2@1 5.08,41.91 5.08,45.72 5.84,46.48 v12.19,46.48 | 35.69,40.64 34.92,41.4 32.26,41.4 31.75,41.91 VCCO_2_1.4 | 35.69,40.64 35.69,39.5 34.8,38.61 34.8,27.18 35.56,26.42 | U$1.2V5W1@4 66.04,8.89 66.04,13.97 64.39,15.62 64.39,21.46 64.26,21.59 | 64.36,39.37 64.36,46.74 53.34,46.74 53.34,46.99 | 53.34,46.99 53.34,43.56 50.67,40.89 v48.9,40.89 | 53.34,46.99 U$1.JTAG_REF | v38.61,40.89 35.94,40.89 35.69,40.64
  Bottom 1.016: v21.72,55.12 19.18,55.12 19.18,46.99 | 19.18,46.99 19.18,47.24 31.75,47.24 VCCO_2_1.4 | v19.18,46.48 19.18,46.99
  pour Bottom (isolate 0.381): 31.75,26.67 36.83,26.67 36.83,21.59 31.75,21.59
3V3  (via drill 0.38)
  Top 0.254: U3.14 43.56,57.9 | U3.26 46.96,52.45 46.99,52.45 | U3.31 49.46,52.45 49.53,52.45 | U3.10 47.46,59.02 47.37,58.93 | U7.3 23.75,8.26 24,8.26 24.13,8.26 | C27.1 26.75,8.26 24.13,8.26 | U7.8 U7.7 22.48,10.54 24.13,8.89 24.13,8.26
  Top 0.406: v63.5,19.05 63.5,11.43 U$1.3V3W1@4 63.5,8.89 v63.5,6.35 | v54.61,38.1 U$1.3V3W1@1 | v63.5,36.83 63.5,31.75 U$1.3V3W1@2
  Top 1.016: U6.2 v28.07,50.93 | v25.53,55.12 28.02,55.12 U6.4
  Bottom 0.406: v63.5,36.83 58.42,36.83 U$1.3V3W1@1 | v54.61,38.1 54.61,39.37 v53.34,40.64 | v63.5,19.05 58.42,19.05 U$1.3V3W1@3 | v53.34,6.35 v63.5,6.35
  Bottom 1.016: v25.53,55.12 28.07,55.12 v28.07,50.93 | v39.62,58.17 v39.62,59.05 v39.62,66.29 v39.62,67.18
  pour Top (isolate 0.254, rank 3): 0,68.58 0,0 68.58,0 68.58,68.58
3V3OUT_A
  Top 0.254: U3.6 49.46,60.9 49.02,61.34 46.99,61.34 46.23,62.1 46.23,62.61 45.21,63.63 C5.2
5V  (via drill 0.38)
  Top 0.254: 57.83,54.77 arc90 C11.2 57.11,55.4 U3.42 50.96,55.4 U3.3 50.96,60.71 50.46,60.71 | R7.2 arc90 57.81,59.39 v59.22,59.39 | 59.74,64.96 C3.2 59.26,64.52 U1.6 56.95,66.37 56.9,66.42 56.28,66.42 R1.1 | 50.46,60.71 U3.4 | 50.46,60.71 50.46,62.19 50.04,62.61 50.04,62.63 C4.2
  Top 0.406: U6.3 30.48,48.87 | U$1.VIW2@2 2.54,16.51 2.54,24.13 4.32,25.91 4.32,34.29 3.81,34.8 U$1.VIW2@1 2.16,35.56 v2.16,44.83 | U$1.VIW1@4 64.77,14.1 64.39,14.48 64.39,18.67 67.31,21.59 67.31,31.75 66.04,33.02 U$1.VIW1@2 64.77,35.81 64.39,36.2 v64.39,49.91 | v59.22,54.77 57.83,54.77 | v59.74,63.6 59.74,64.96
  Top 1.016: 30.35,48.97 U6.3 30.38,51.31 | v12.09,51.61 12.09,52.5 15.24,52.5 | 15.24,52.5 21.59,52.5 | 21.59,52.5 23.24,52.5 | 23.24,52.5 30.38,52.5 30.38,51.31 | 15.24,52.5 15.73,52.5 C8.1 15.73,56.77 15.37,56.77 15.37,57.91 R5.2 | 21.59,52.5 21.49,52.5 | PWRSELECT.2 35.18,52.07 35.18,51.31 30.38,51.31 | 23.24,52.5 23.62,52.5 | U5.3 21.49,52.4 21.59,52.5
  Bottom 0.254: v59.22,54.77 59.22,54.72
  Bottom 0.406: U$1.VIW1@1 58.42,34.29 64.77,34.29 U$1.VIW1@2 | U$1.VIW1@4 63.5,13.97 58.42,13.97 U$1.VIW1@3 | v59.22,54.77 v59.22,59.39 59.22,63.6 v59.74,63.6 | 59.22,54.72 C11.2 | v64.39,49.91 64.39,54.23 63.37,55.24 59.7,55.24 v59.22,54.77 | v12.09,51.61 12.09,51.56 2.16,51.56 v2.16,44.83 | PWRSELECT.2 48.39,52.07 48.39,55.63 59.22,55.63 v59.22,54.77
D+
  Top 0.254: R2.1 40.77,65.53 38.73,63.5 34.04,63.5 33.02,62.48 USB.3
D-
  Top 0.254: USB.2 33.82,61.12 34.16,61.47 36.2,61.47 36.45,61.72 R6.1
DO_A
  Top 0.254: U1.1 53.95,64.52 53.95,65.28 | R4.1 53.8,65.14 53.95,65.28 | 53.95,65.28 53.95,66.25 R1.2
EECS_A
  Top 0.254: U3.48 53.46,58.55 52.96,59.05 52.96,60.33 53.59,60.96 57.15,60.96 58.42,62.23 58.42,63.12 57.91,63.63 57,63.63 U1.5
EEDATA_A
  Top 0.254: U3.2 51.46,62.23 | 51.46,62.23 51.46,63.13 R4.2 | U1.3 51.46,62.62 51.46,62.23
EESK
  Top 0.254: U3.1 51.96,60.98 52.7,61.72 55.03,61.72 55.03,61.76 55.88,62.61 56.94,62.61 U1.4
FILTERED_VCC_A
  Top 0.2: C7.2 R7.1
  Top 0.254: U3.46 55.6,57.4 C7.2
FLASH_CS  (via drill 0.38)
  Top 0.254: S3E.24 27.39,18.63 v27.66,18.36 | U7.1 v21.21,10.16
  Bottom 0.254: v27.66,18.36 27.66,17.5 26.67,16.51 23.24,16.51 21.21,14.48 v21.21,10.16
FLASH_SCK  (via drill 0.38)
  Top 0.254: S3E.50 40.51,16.38 v41.15,17.02 | U7.6 23.75,10.67 24,10.41 v25.02,10.41
  Bottom 0.254: v41.15,17.02 31.37,17.02 31.11,16.76 31.11,12.83 28.7,10.41 v25.02,10.41
FLASH_SI  (via drill 0.38)
  Top 0.254: S3E.27 28.79,14.95 v28.32,14.48 | v26.44,13.72 25.27,13.72 25.02,13.46 U7.5
  Bottom 0.254: v26.44,13.72 27.56,13.72 v28.32,14.48
FLASH_SO  (via drill 0.38)
  Top 0.254: v29.95,19.51 27.36,16.92 27.33,16.92 v25.65,15.24 | S3E.44 37.29,18.03 35.81,19.51 v31.62,19.51 | U7.2 v22.48,8.89
  Bottom 0.254: v29.95,19.51 v31.62,19.51 | v25.65,15.24 23.24,15.24 22.48,14.48 v22.48,8.89
GND  (via drill 0.38)
  Top 0.2: v47.96,58.09 U3.9 | U3.18 v46.27,55.9 | v50.96,53.21 U3.34 | v52.16,56.9 U3.45 | v52.16,57.9 U3.47
  Top 0.25: C12.1 v66.09,54.98 | v66.09,57.32 C6.1
  Top 0.254: S3E.52 40.74,18.63 v40.74,18.59 | S3E.59 40.74,22.13 40.11,22.76 v40.08,22.76 | S3E.64 40.74,24.63 40.29,24.18 v40.08,24.18 | S3E.72 40.74,28.63 v40.74,26.67 | S3E.93 31.79,30.38 v32.21,30.38 34.79,30.38 | 34.79,30.38 S3E.87 | S3E.7 27.94,27.13 28.24,27.43 v29.57,27.43 | S3E.14 27.94,23.63 28.9,24.59 v29.46,24.59 | S3E.19 27.94,21.13 v29.57,22.76 | S3E.81 37.79,28.96 v38.1,28.96 | 33.79,17.3 S3E.37 | 33.79,17.3 33.79,18.21 v33.83,18.21 | v30,18.39 29.79,18.18 S3E.29 | v37.72,24.51 v37.72,26.16 | S3E.42 36.29,16.97 35.97,17.3 34.8,17.3 | 34.8,17.3 S3E.39 | 34.8,17.3 33.79,17.3 | S3E.99 28.79,31.15 29.21,30.73 29.21,28.83 v29.34,28.7 | C7.1 55.63,59.44 54.48,59.44 | 54.48,59.44 v54.1,59.44 | C11.1 57.78,52.83 v59.18,52.83 | U1.2 53.09,63.57 v53.09,63.5 | v61.71,63.59 C3.1 | 34.79,30.38 35.69,30.38 v35.69,30.35 | v53.72,51.69 53.09,51.69 51.56,53.21 v50.97,53.21 v50.96,53.21 | C5.1 41.53,63.63 v40.89,62.99 | C4.1 49.53,65.66 v48.64,66.55 | U3.25 46.46,50.65 v46.1,50.29 | U3.47 54.48,57.9 54.48,59.44 | 47.66,32.17 v47.75,32.26 | C19.2 44.58,32.51 | U7.4 25.02,5.25 C27.2 28.07,5.25 v28.07,5.21
  Top 0.406: C9.1 33.21,54.23 31.42,54.23 USB.5 | v49.91,54.48 v49.91,56.77
  Top 0.61: C28.2 C29.2 41.11,12.92 v41.27,13.08 | v32.13,8.64 32,8.76 32,8.89 C31.2 30.64,9.74 30.1,10.29 C30.2 | C24.2 21.36,19.99 v21.08,20.27 20.46,19.65 C23.2 | C21.2 v18.67,29.34 | C22.2 v18.67,27.18 | C18.2 C17.2 26.96,35.73 v26.04,34.8 | v26.04,34.8 v26.04,33.91 v22.86,33.91 | v26.04,34.8 26.04,34.92 | v22.86,34.8 v26.04,34.8 | v41.02,37.47 41.01,37.45 | C16.2 37.59,37.47 v38.35,38.23 41.02,38.23 v41.02,37.47 | C25.2 v44.58,16 | C26.2 46.48,16.51 v45.97,16 | C20.2 47.66,32.17 | 44.58,32.51 v45.59,33.53 | C15.2 40.8,37.25 v41.02,37.47
  Top 0.813: OSC.2@2 22.5,37.95 v22.5,37.54
  Top 1.016: U5.1 16.89,48.97 v16.89,50.93 16.89,50.91 C13.2 | 25.76,50.93 v25.78,50.93 | U6.1 25.76,50.93 | 25.76,50.93 25.76,50.91 C14.2 | C10.2 R9.2 3.17,61.57 PWR1.2 | C8.2 13.73,56.88 v13.72,56.9 | U4.1 3.81,48.97 U$1.GNDW2@1 | C9.1 33.23,53.38 v33.73,52.88 | v32.73,52.88 32.73,52.92 33.15,53.34 | C1.2 19.05,64.41 v19.05,62.74 19.05,57.86 U2.1 | RPAR.2 v21.72,44.58 | C2.2 24.53,66.41 v24.51,66.42 | PWR.C 15.33,61.21 16.76,61.21 PWRIN.2
  Bottom 0.254: v59.18,52.83 59.18,53.21 | U$1.JTAG_GND 50.8,48.77 v53.72,51.69
  Bottom 0.61: v32.13,8.64 32.26,8.64
  pour Bottom (isolate 0.305, rank 3): 0,68.58 68.58,68.58 68.58,0 0,0
N$1
  Top 1.016: R5.1 17.38,59.82 PWR.A
N$2
  Top 0.254: RX.C R12.2
N$3
  Top 0.254: TX.C R13.2
N$4
  Top 0.254: U3.27 47.46,49.69 47.62,49.53 54.61,49.53 55.24,48.9 55.24,48.26 55.88,47.62 R13.1
N$5
  Top 0.254: U3.28 47.96,50.46 48.26,50.16 56.2,50.16 56.2,50.12 R12.1
N$15_A
  Top 0.254: U3.5 49.96,61.42 49.4,61.98 48.01,61.98 47.62,62.36 R3.2
OSC_IN
  Top 0.254: S3E.89 33.79,38.35 33.02,39.12 33.02,40.89 32.51,41.4 25.03,41.4 OSC.3@3
S$13  (via drill 0.81)
  other vias: 17.78,5.08
S$14  (via drill 0.81)
  other vias: 50.8,43.18
S$15  (via drill 0.81)
  other vias: 50.8,5.08
TCK  (via drill 0.38)
  Top 0.254: R11.2 40.91,50.78 41.27,50.42 43.05,50.42 v44.45,49.02 | S3E.77 39.79,32.8 40.01,33.02 41.91,33.02 v44.45,35.56
  Bottom 0.254: U$1.JTAG_TCK 46.99,49.53 45.09,49.53 44.58,49.02 v44.45,49.02 v44.45,35.56
TDI  (via drill 0.38)
  Top 0.254: v30.48,45.72 v34.29,45.72 | R10.2 39.88,53.34 39.62,53.09 39.62,50.67 40.77,49.53 41.91,49.53 U$1.JTAG_TDI | S3E.100 27.81,31.88 v27.43,32.26
  Bottom 0.254: v34.29,45.72 40.64,45.72 U$1.JTAG_TDI | v27.43,32.26 27.43,35.94 30.48,38.99 v30.48,45.72
TDO  (via drill 0.38)
  Top 0.254: U$1.JTAG_TDO 45.72,49.15 44.83,50.04 44.83,50.67 45.72,51.56 45.72,52.2 46.35,52.83 46.35,53.47 45.92,53.9 U3.22 | S3E.76 42.04,31.88 v45.72,35.56
  Bottom 0.254: v45.72,35.56 U$1.JTAG_TDO
TMS  (via drill 0.38)
  Top 0.254: R8.2 39.75,55.24 38.99,54.48 38.99,50.29 40.64,48.64 U$1.JTAG_TMS | S3E.75 42.04,30.98 v41.91,31.11
  Bottom 0.254: v41.91,31.11 41.27,31.11 39.37,33.02 39.37,43.18 38.1,44.45 33.66,44.45 33.02,45.09 33.02,46.99 33.66,47.62 40.01,47.62 U$1.JTAG_TMS
USB_RXD  (via drill 0.38)
  Top 0.254: S3E.90 33.29,37.83 32.26,38.86 28.7,38.86 26.92,40.64 23.11,40.64 22.61,41.15 22.61,44.2 v23.5,45.09 | v49.53,47.24 49.17,46.89 30.12,46.89 v28.32,45.09 | U3.39 54.05,53.9 v55.24,52.7
  Bottom 0.254: v23.5,45.09 v28.32,45.09 | v49.53,47.24 49.53,48.9 53.34,52.7 v55.24,52.7
USB_TCK
  Top 0.254: U3.24 44.96,51.95 44.45,51.44 R11.1
USB_TDI
  Top 0.254: U3.23 42.97,53.4 R10.1
USB_TMS
  Top 0.254: U3.21 43.76,54.4 R8.1
USB_TXD  (via drill 0.38)
  Top 0.254: S3E.88 34.29,38.35 35.56,39.62 35.56,45.47 36.52,46.43 50.24,46.43 50.8,46.99 v52.07,46.99 | U3.40 55.59,54.4 v55.75,54.23
  Bottom 0.254: v55.75,54.23 56.26,53.72 56.26,52.2 55.37,51.31 54.48,51.31 52.07,48.9 v52.07,46.99
USBDM_A
  Top 0.254: U3.8 48.46,60.63 48.26,60.83 46.23,60.83 45.34,61.72 R6.2
USBDP_A  (via drill 0.38)
  Top 0.254: U3.7 48.96,57.85 v49.02,57.78 | R3.1 | R3.1 47.51,65.02 | 46.23,65.14 46.1,65.14 v46.1,64.26 | 46.23,65.14 R3.1 | R2.2 44.18,65.14 46.23,65.14
  Bottom 0.254: v49.02,57.78 49.02,64.26 v46.1,64.26
VBUS_A  (via drill 0.38)
  Top 0.406: 34.62,56.26 USB.1 | 34.62,56.26 34.54,56.26 | 34.62,56.26 v34.67,56.26 33.23,56.26 C9.2
  Bottom 0.406: 34.54,56.26 v34.67,56.26 34.8,56.26 34.8,49.53 PWRSELECT.1
VCCO  (via drill 0.38)
  Top 0.203: 39.32,16.23 39.24,16.31 39.29,16.35 S3E.48 | S3E.48 S3E.49 39.79,15.71 39.88,15.62 40.89,15.62 42.04,14.48 42.04,12.57 41.15,11.68 36.96,11.68 36.58,12.06 36.58,14.61 | S3E.48 S3E.47 | S3E.43 36.79,15.58 36.58,15.37 36.58,14.61 | C28.1 36.58,14.52 36.58,14.61
  Top 0.254: 31.24,27.94 29.79,29.39 S3E.97 29.79,32.82 29.59,33.02 28.46,33.02 28.46,34.02 28.32,34.16 27.6,34.16 C17.1 | 31.93,27.89 31.93,27.81 32,27.81 | 37.69,22.05 37.72,22.05 38.99,20.78 38.99,20.13 S3E.55 43.86,20.13 44.58,19.41 C25.1 | 37.9,27.53 39.12,28.75 39.12,29.13 S3E.73 45.64,29.13 46.48,29.97 C20.1 | S3E.45 | 26.54,26.62 S3E.8 | S3E.20 | S3E.45 37.79,19.38 | 37.79,19.38 37.77,19.38 | 37.79,19.38 37.11,19.38 35.87,20.62 | 26.54,26.62 28.96,26.62 29.87,25.7 30.79,25.7 | S3E.20 28.17,20.63 28.5,20.95 30.15,20.95 30.48,20.62 30.79,20.62 S3E.31 30.79,13.14 30.73,13.08 30.1,13.08 C30.1 | S3E.20 25.47,20.63 25.02,21.08 19.98,21.08 C23.1 | 37.47,27.3 37.29,27.48 S3E.82 37.29,34.84 C16.1 | 26.54,26.62 22.44,26.62 C22.1 | C28.1 37.79,14.59 S3E.45
  Top 0.406: VCCO_2_1.3 VCCO_2_1.1
  Top 0.813: 30.79,25.7 30.79,21.84 34.85,21.84 v34.85,25.5
  Bottom 0.406: VCCO_2_1.3 VCCO_2_1.5 34.21,40.06 34.21,26.14 v34.85,25.5
  pour Top (isolate 0.305): 38.1,27.94 38.1,20.32 30.48,27.94
  pour Top (isolate 0.305): 30.48,20.32 36.83,20.32 30.48,26.67
VI  (via drill 0.38)
  Top 1.016: C1.1 22.1,66.41 22.1,64.06 U2.4 | U2.4 22.86,64.14 | U2.2 v22.86,60.96 U2.4
  Bottom 1.016: v22.86,60.96 22.86,59.05 36.96,59.05 PWRSELECT.3
VI_PWRJACK  (via drill 0.38)
  Top 1.016: C2.1 v26.04,62.61 v26.04,61.59 26.04,60.33 25.15,59.44 25.15,57.89 U2.3
  Bottom 1.016: v26.04,61.59 v26.04,62.61 C2.1 26.04,64.77 20.32,64.77 20.32,65.53 PWRIN.1 14.94,65.53 PWR1.3
W1_A1
  Top 0.254: U$1.A1@1 62.23,3.81 59.31,0.89 19.18,0.89 16.51,3.56 16.51,6.35 18.03,7.87 18.03,17.02 18.54,17.53 18.54,22.23 18.8,22.48 20.83,22.48 21.68,21.63 S3E.18
W1_A2
  Top 0.254: S3E.23 25.99,19.13 24.89,18.03 21.34,18.03 19.56,16.26 19.56,3.81 20.83,2.54 55.12,2.54 58.93,6.35 60.96,6.35 U$1.A2@1
W1_A3
  Top 0.254: S3E.26 28.29,16.1 27.43,15.24 27.43,8.38 28.19,7.62 57.15,7.62 58.42,8.89 60.96,8.89 U$1.A3@1
W1_A4
  Top 0.254: S3E.33 31.79,11.14 34.29,8.64 55.8,8.64 58.6,11.43 60.96,11.43 U$1.A4@1
W1_A5
  Top 0.203: S3E.35 32.79,11.66 34.8,9.65 42.93,9.65 45.97,12.7 53.03,12.7 54.18,13.84 60.83,13.84 U$1.A5@1
W1_A6
  Top 0.203: S3E.40 35.29,11.78 36.3,10.77 42.01,10.77 44.96,13.72 50.8,13.72 53.34,16.26 60.71,16.26 U$1.A6@1
W1_A7
  Top 0.203: S3E.53 42.59,19.13 42.93,18.8 42.93,15.24 43.43,14.73 47.24,14.73 51.31,18.8 60.71,18.8 U$1.A7@1
W1_A8
  Top 0.203: S3E.57 55.93,21.13 56.13,21.34 60.71,21.34 U$1.A8@1
W1_A9
  Top 0.254: S3E.60 55.14,22.63 56.64,24.13 60.96,24.13 U$1.A9@1
W1_A10
  Top 0.254: S3E.62 53.35,23.63 56.39,26.67 60.96,26.67 U$1.A10@1
W1_A11
  Top 0.254: S3E.65 49.26,25.13 53.09,28.96 61.98,28.96 62.23,29.21 U$1.A11@1
W1_A12
  Top 0.254: U$1.A12@1 60.96,31.75 58.42,31.75 56.59,33.58 53.59,33.58 46.15,26.13 S3E.67
W1_A13
  Top 0.203: S3E.70 46.17,27.63 53.09,34.54 61.21,34.54 U$1.A13@1
W1_A14
  Top 0.203: S3E.79 38.79,33.33 39.95,34.49 40.84,34.49 45.72,39.37 60.96,39.37 U$1.A14@1
W1_A15
  Top 0.203: S3E.84 36.29,33.56 35.81,34.04 35.81,37.59 37.08,38.86 37.08,43.94 38.1,44.96 56.9,44.96 58.42,43.43 58.42,42.67 59.18,41.91 60.96,41.91 U$1.A15@1
W1_A16
  Top 0.203: S3E.86 35.29,32.78 34.8,33.27 34.8,38.1 36.07,39.37 36.07,45.21 36.83,45.97 59.44,45.97 U$1.A16@1
W1_B1
  Top 0.203: S3E.85 35.79,33.3 35.31,33.78 35.31,37.85 36.58,39.12 36.58,44.7 37.34,45.47 57.4,45.47 U$1.B1@1
W1_B2
  Top 0.203: S3E.83 36.79,33.82 36.32,34.29 36.32,37.34 37.85,38.86 37.85,43.69 38.61,44.45 53.85,44.45 56.52,41.78 58.55,41.78 U$1.B2@1
W1_B3
  Top 0.203: S3E.78 39.29,33.19 39.88,33.78 41.15,33.78 44.45,37.08 58.67,37.08 U$1.B3@1
W1_B4
  Top 0.203: S3E.71 45.91,28.13 54.36,36.58 58.67,36.58 U$1.B4@1
W1_B5
  Top 0.203: S3E.68 45.93,26.63 53.34,34.04 58.67,34.04 U$1.B5@1
W1_B6
  Top 0.254: S3E.66 47.7,25.63 51.46,29.39 58.6,29.39 U$1.B6@1
W1_B7
  Top 0.254: S3E.63 49.78,24.13 53.59,27.94 U$1.B7@1
W1_B8
  Top 0.254: S3E.61 54.24,23.13 56.52,25.4 U$1.B8@1
W1_B9
  Top 0.203: S3E.58 42.97,21.63 43.18,21.84 58.67,21.84 U$1.B9@1
W1_B10
  Top 0.203: S3E.54 43.11,19.63 43.43,19.3 43.43,15.75 43.94,15.24 46.61,15.24 50.55,19.18 58.55,19.18 U$1.B10@1
W1_B11
  Top 0.203: S3E.41 35.79,12.01 36.6,11.2 41.43,11.2 44.45,14.22 48.77,14.22 51.18,16.64 58.55,16.64 U$1.B11@1
W1_B12
  Top 0.203: S3E.36 33.29,12.18 35.31,10.16 42.42,10.16 45.47,13.21 52.45,13.21 53.47,14.22 58.67,14.22 U$1.B12@1
W1_B13
  Top 0.254: S3E.34 32.29,11.4 34.54,9.14 43.43,9.14 46.23,11.94 53.16,11.94 54.48,13.26 56.31,13.26 56.87,12.7 U$1.B13@1
W1_B14
  Top 0.254: S3E.32 31.29,10.87 34.04,8.13 56.39,8.13 58.42,10.16 U$1.B14@1
W1_B15
  Top 0.254: S3E.25 26.51,18.13 25.91,17.53 21.84,17.53 20.32,16 20.32,4.06 21.21,3.17 53.98,3.17 58.42,7.62 U$1.B15@1
W1_B16
  Top 0.254: U$1.B16@1 59.69,3.81 57.66,1.78 19.81,1.78 18.8,2.79 18.8,16.38 21.08,18.67 24.77,18.67 25.73,19.63 S3E.22
W2_A1
  Top 0.254: S3E.91 32.79,37.57 32,38.35 28.45,38.35 26.67,40.13 9.14,40.13 6.35,42.93 U$1.A1@2
W2_A2
  Top 0.254: S3E.92 32.29,37.31 31.75,37.85 28.19,37.85 26.42,39.62 7.37,39.62 U$1.A2@2
W2_A3
  Top 0.254: S3E.94 31.29,36.78 30.73,37.34 26.29,37.34 25.27,36.32 16,36.32 14.22,38.1 U$1.A3@2
W2_A4
  Top 0.203: S3E.95 30.79,36.52 30.48,36.83 27.43,36.83
  Top 0.254: 27.43,36.83 26.67,36.83 25.4,35.56 U$1.A4@2
W2_A5
  Top 0.203: S3E.98 29.29,32.56 29.23,32.61 28.14,32.61 27.74,33.02 U$1.A5@2
W2_A6
  Top 0.254: S3E.2 25.74,29.63 23.37,32 7.87,32 U$1.A6@2
W2_A7
  Top 0.254: S3E.3 25.48,29.13 23.11,31.5 9.91,31.5 U$1.A7@2
W2_A8
  Top 0.254: S3E.4 25.22,28.63 22.86,30.99 11.94,30.99 U$1.A8@2
W2_A9
  Top 0.254: S3E.5 25.08,28.13 22.73,30.48 13.97,30.48 U$1.A9@2
W2_A10
  Top 0.254: S3E.9 12.16,26.13 U$1.A10@2
W2_A11
  Top 0.254: S3E.10 14.2,25.63 U$1.A11@2
W2_A12
  Top 0.254: S3E.11 16.75,25.13 6.86,15.24 U$1.A12@2
W2_A13
  Top 0.254: S3E.12 18.03,24.63 11.43,18.03 11.43,16.76 7.37,12.7 U$1.A13@2
W2_A14
  Top 0.254: U$1.A14@2 10.16,10.16 15.24,15.24 15.24,17.78 16.64,19.18 16.64,22.48 18.16,24 22.23,24 23.1,23.13 S3E.15
W2_A15
  Top 0.254: U$1.A15@2 10.16,7.62 16,13.46 16,16.89 17.4,18.29 17.4,22.61 18.29,23.5 21.59,23.5 22.45,22.63 S3E.16
W2_A16
  Top 0.254: U$1.A16@2 10.29,5.08 16.89,11.68 16.89,16.89 18.03,18.03 18.03,22.48 18.54,22.99 21.21,22.99 22.07,22.13 S3E.17
XTIN_A
  Top 0.2: U3.43 61.2,55.9 62.15,54.95 X1.2
  Top 0.254: C12.2 62.65,51.65 62.23,52.07 62.23,53.66 X1.2
XTOUT_A
  Top 0.2: U3.44 61.2,56.4 62.15,57.35 X1.1
  Top 0.254: C6.2 63.19,60.65 62.23,59.69 62.23,58.64 X1.1

### Text on the board
tPlace: VI | GND | Jack | USB | 1.2V | 2.5V | 3.3V | VCCO | BL | B | AH | A | BH | AL | 6/30/2010 | CL | C | CH | Papilio Platform | Papilio One | www.GadgetFactory.net | USB FPGA REDe | BPC3003 V2.04 | Copyright 2009-2010 | Gadget Factory, LLC
test: PORTE | PORTA
Ports: PORTB | PORTF
Port2: PORTC
Port3: PORTD